# EasyEDA Pro project MFU.eprj, schematic MAIN_BOARD
Board Name: MAIN_BOARD; Create Date: 2025-10-30; Page Name: P1; Project Name: MFU_V3_mainboard; Schematic Name: MAIN_BOARD; Update Date: 2026-01-19; Company: EasyEDA.com; Page Size: A4; Version: V1.0
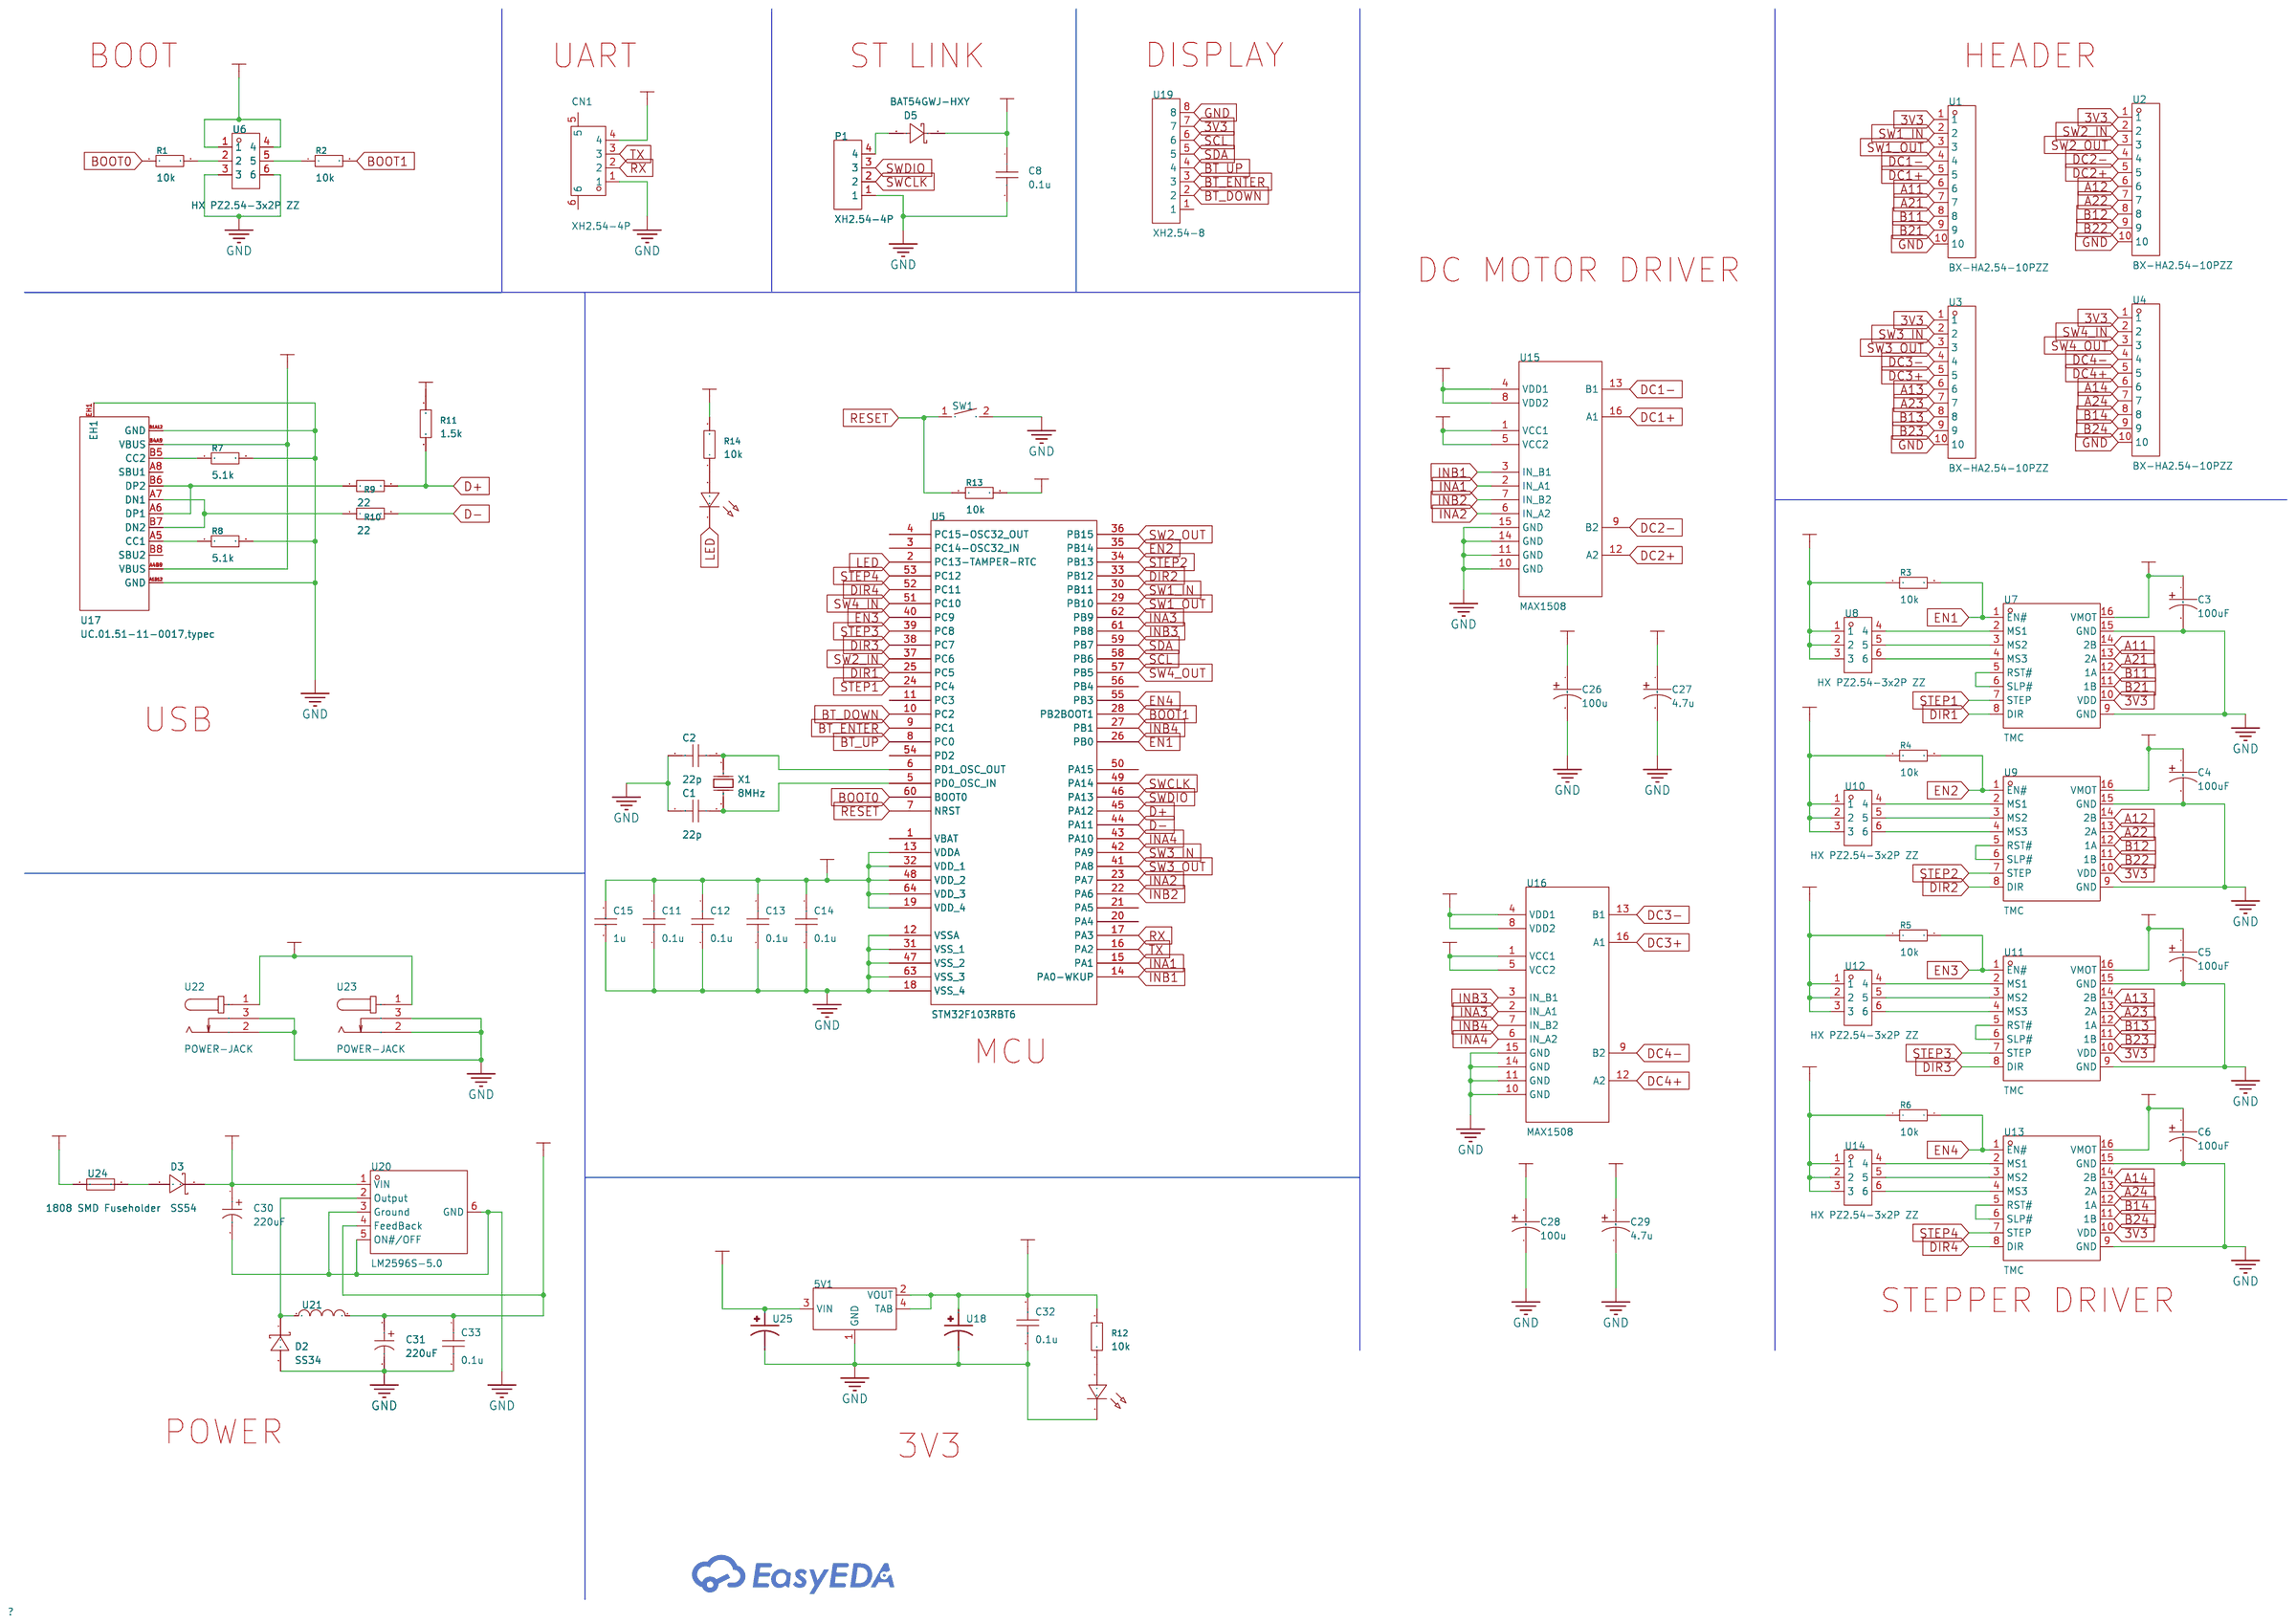
[diagram p0: schematic sheet]

## Parts
5V1  -  [SOT-223_L6.7-W3.5-P2.30-BR]
C1  22p  [C0805]
C2  22p  [C0805]
C3  100uF  [CAP-SMD_BD6.3-L6.6-W6.6-FD]
C4  100uF  [CAP-SMD_BD6.3-L6.6-W6.6-FD]
C5  100uF  [CAP-SMD_BD6.3-L6.6-W6.6-FD]
C6  100uF  [CAP-SMD_BD6.3-L6.6-W6.6-FD]
C8  0.1u  [C0805]
C11  0.1u  [C0805]
C12  0.1u  [C0805]
C13  0.1u  [C0805]
C14  0.1u  [C0805]
C15  1u  [C1206]
C26  100u  [CAP-SMD_BD6.3-L6.6-W6.6-FD]
C27  4.7u  [CAP-SMD_BD6.3-L6.6-W6.6-FD]
C28  100u  [CAP-SMD_BD6.3-L6.6-W6.6-FD]
C29  4.7u  [CAP-SMD_BD6.3-L6.6-W6.6-FD]
C30  220uF  [CAP-SMD_BD8.0-L8.3-W8.3-LS10.0-FD-1]
C31  220uF  [CAP-SMD_BD8.0-L8.3-W8.3-LS10.0-FD-1]
C32  0.1u  [C0805]
C33  0.1u  [C0805]
CN1  XH2.54-4P  [CONN-SMD_4P-P2.50-WT]
D2  SS34  [SMA_L4.4-W2.8-LS5.4-RD]
D3  SS54  [SMA_L4.4-W2.8-LS5.4-RD]
D5  BAT54GWJ-HXY  [SOD-123_L2.7-W1.6-LS3.7-RD]
LED2  -  [LED0603-R-RD]
LED3  -  [LED0603-R-RD]
P1  XH2.54-4P  [CONN-TH_4P-P2.50-XH2.54-4P]
R1  10k  [R0805]
R2  10k  [R0805]
R3  10k  [R0805]
R4  10k  [R0805]
R5  10k  [R0805]
R6  10k  [R0805]
R7  5.1k  [R0805]
R8  5.1k  [R0805]
R9  22  [R0805]
R10  22  [R0805]
R11  1.5k  [R0805]
R12  10k  [R0805]
R13  10k  [R0805]
R14  10k  [R0805]
SW1  key_3x6_2P  [SW-SMD_L6.0-W3.5-LS8.0]
U1  BX-HA2.54-10PZZ  [CONN-TH_10P-P2.50_BX-HA2.54-10PZZ]
U2  BX-HA2.54-10PZZ  [CONN-TH_10P-P2.50_BX-HA2.54-10PZZ]
U3  BX-HA2.54-10PZZ  [CONN-TH_10P-P2.50_BX-HA2.54-10PZZ]
U4  BX-HA2.54-10PZZ  [CONN-TH_10P-P2.50_BX-HA2.54-10PZZ]
U5  STM32F103RBT6  [LQFP-64_L10.0-W10.0-P0.50-LS12.0-BL]
U6  HX PZ2.54-3x2P ZZ  [HDR-TH_6P-P2.54-V-M-R3-C2-S2.54_2]
U7  TMC  [DIP-16_L20.3-W15.2-P2.54_LS12.7_A4988]
U8  HX PZ2.54-3x2P ZZ  [HDR-TH_6P-P2.54-V-M-R3-C2-S2.54_2]
U9  TMC  [DIP-16_L20.3-W15.2-P2.54_LS12.7_A4988]
U10  HX PZ2.54-3x2P ZZ  [HDR-TH_6P-P2.54-V-M-R3-C2-S2.54_2]
U11  TMC  [DIP-16_L20.3-W15.2-P2.54_LS12.7_A4988]
U12  HX PZ2.54-3x2P ZZ  [HDR-TH_6P-P2.54-V-M-R3-C2-S2.54_2]
U13  TMC  [DIP-16_L20.3-W15.2-P2.54_LS12.7_A4988]
U14  HX PZ2.54-3x2P ZZ  [HDR-TH_6P-P2.54-V-M-R3-C2-S2.54_2]
U15  MAX1508  [SOP-16_L10.0-W3.9-P1.27-LS6.0-BL]
U16  MAX1508  [SOP-16_L10.0-W3.9-P1.27-LS6.0-BL]
U17  UC.01.51-11-0017,typec  [TYPE-C-SMD_UC.01.51-11-0017]
U18  TAJA106M010RNJ  [CAPMP3216X180N]
U19  XH2.54-8  [CONN-TH_8P-P2.54_XH2.54_C9900012080]
U20  LM2596S-5.0  [TO-263-5_L10.1-W8.7-P1.70-LS14.4-BR]
U21  INDUCTOR/100uH-3A  [IND-SMD_L11.0-W10.2_CXP1050]
U22  POWER-JACK  [DC-IN-TH_POWER-JACK]
U23  POWER-JACK  [DC-IN-TH_POWER-JACK]
U24  1808 SMD Fuseholder  [FUSE-SMD_L9.7-W5.0]
U25  TAJA106M010RNJ  [CAPMP3216X180N]
X1  8MHz  [CRYSTAL-SMD_L11.5-W4.8-LS12.7]

## Library data of the parts
5V1 = AMS1117-3.3V: Supplier Footprint: SOT-223
C1 C2 C8 C11-C14 C32 C33 = CAP_0805: Supplier Footprint: 0805
C3-C6 C26-C29 = EEE0JA101AP: LCSC Part Name: 100uF ±20% 6.3V; Supplier Part: C336351; Manufacturer: PANASONIC(松下); Supplier Footprint: SMD,D6.3xL5.4mm; JLCPCB Part Class: Extended Part; Datasheet: https://atta.szlcsc.com/upload/public/pdf/source/20190304/C336351_6632A94A5AB1703B0BF3102A4E78E308.pdf; Supplier: LCSC; Tolerance: ±20%; Voltage Rating: 6.3V; Ripple Current: 71mA@120Hz; Diameter: 6.3mm; Height - Seated (Max): 5.4mm; Lifetime: 1000hrs@85℃; Operating Temperature: -40℃~+85℃
C15 = CL31A107MQHNNNE: Capacitance:100uF Tolerance:±20% Tolerance:±20% Voltage Rating:6.3V Temperature Coefficient:X5R; LCSC Part Name: 100uF ±20% 6.3V; Supplier Part: C15008; Manufacturer: SAMSUNG(三星); Supplier Footprint: 1206; JLCPCB Part Class: Basic Part; Datasheet: https://item.szlcsc.com/datasheet/CL31A107MQHNNNE/15681.html; Supplier: LCSC; Tolerance: ±20%; Voltage Rating: 6.3V; Temperature Coefficient: X5R
C30 C31 = 875075355002: LCSC Part Name: 220uF ±20% 16V; Supplier Part: C2162422; Manufacturer: Wurth(伍尔特); Supplier Footprint: SMD,D8xL11.7mm; JLCPCB Part Class: Extended Part; Datasheet: https://www.we-online.com/components/products/datasheet/875075355002.pdf; Supplier: LCSC; Tolerance: ±20%; Voltage Rating: 16V; Ripple Current: 4.7A@100kHz; Equivalent Series Resistance(ESR): 10mΩ@100kHz; Type: Polymer; Diameter: 8mm; Height - Seated (Max): 11.7mm; Lifetime: 2000hrs@105℃; Operating Temperature: -55℃~+105℃
CN1 = XH2.54-4P: Supplier Part: C9900004347; Supplier Footprint: XH2.54-3PSMD; JLCPCB Part Class: Extended Part; Supplier: LCSC
D2 D3 = SS34: LCSC Part Name: 电压:40V 电流:3A; Supplier Part: C142458; Supplier Footprint: SMA(DO-214AC); JLCPCB Part Class: Extended Part; Datasheet: https://atta.szlcsc.com/upload/public/pdf/source/20171114/C142458_15106326937931117548.pdf; Supplier: LCSC; Forward Voltage (Vf@If): 500mV@3A; Reverse Voltage (Vr): 40V; Average Rectified Current (Io): 3A
D5 = BAT54GWJ-HXY: Supplier Part: C52754565; Manufacturer: HXY MOSFET(华轩阳电子); Supplier Footprint: SOD-123; JLCPCB Part Class: Extended Part; Datasheet: https://item.szlcsc.com/datasheet/BAT54GWJ-HXY/55658096.html; Supplier: LCSC
LED2 LED3 = LED_0603-B: Supplier Footprint: 0603
P1 = XH2.54-4P_C9900003326: Supplier Part: C9900003326; JLCPCB Part Class: Extended Part; Supplier: LCSC
R1-R11 = 0805W8F1201T5E: LCSC Part Name: 1.2kΩ ±1% 125mW 厚膜电阻; Supplier Part: C17379; Manufacturer: UNI-ROYAL(厚声); Supplier Footprint: 0805; JLCPCB Part Class: Basic Part; Datasheet: https://item.szlcsc.com/datasheet/0805W8F1201T5E/18067.html; Supplier: LCSC; Type: Thick Film Resistor; Tolerance: ±1%; Power(Watts): 125mW; Voltage-Supply(Max): 150V; Temperature Coefficient: ±100ppm/℃; Operating Temperature: -55℃~+155℃
R12-R14 = 0805W8F2001T5E: Type:Thick Film Resistors Resistance:2kΩ Tolerance:±1% Tolerance:±1% Power(Watts): Overload Voltage (Max): Temperature Coefficient:±100ppm/℃ Temperature Coefficient:±100ppm/℃ Operating Temperature Range:-55℃~+155℃ Operating Temperature Range:-55℃~+155℃; LCSC Part Name: 2kΩ ±1% 125mW 厚膜电阻; Supplier Part: C17604; Manufacturer: UNI-ROYAL(厚声); Supplier Footprint: 0805; JLCPCB Part Class: Basic Part; Datasheet: https://atta.szlcsc.com/upload/public/pdf/source/20200306/C422600_1E6D84923E4A46A82E41ADD87F860B5C.pdf; Supplier: LCSC; Type: Thick Film Resistors; Tolerance: ±1%; Temperature Coefficient: ±100ppm/℃; Operating Temperature Range: -55℃~+155℃
SW1 = key_3x6_2P: Supplier Part: C9900016923; JLCPCB Part Class: Extended Part; Supplier: LCSC
U1-U4 = BX-HA2.54-10PZZ_C9900095090: Supplier Part: C9900095090; JLCPCB Part Class: Extended Part; Supplier: LCSC
U5 = STM32F103RBT6: LCSC Part Name: 主流增强型ARM Cortex-M3 MCU，具有128 KB Flash、72 MHz CPU、电机控制、USB和CAN; Supplier Part: C8735; Manufacturer: ST(意法半导体); Supplier Footprint: LQFP-64(10x10); JLCPCB Part Class: Extended Part; Datasheet: https://atta.szlcsc.com/upload/public/pdf/source/20150811/1457707344439.pdf; Supplier: LCSC; CPU Core: ARM-M3; CPU Maximum Speed: 72MHz; Program Storage Size: 128KB; Program Memory Type: FLASH; Number of I/O: 51; ADC (Bit): 12bit; Voltage - Supply: 2V~3.6V
U6 U8 U10 U12 U14 = HX PZ2.54-3x2P ZZ: Pin Structure:3x2P Pitch:2.54mm Row Spacing:2.54mm Circluar Pins/Square Pins:Pin Header Mounting Type:Through Hole Number of Rows:3 Number of Pins:6P Current Rating:3A Voltage Rating (Max):1kV Length of Mating Pin:6mm Insulation Height:2.5mm Length of End; LCSC Part Name: 3x2P 间距:2.54mm 方针 直插; Supplier Part: C32713289; Manufacturer: hanxia(韩下); Supplier Footprint: 插件,P=2.54mm; JLCPCB Part Class: Extended Part; Datasheet: https://item.szlcsc.com/datasheet/HX%2520PZ2.54-3x2P%2520ZZ/34444569.html; Supplier: LCSC; Pin Structure: 3x2P; Pitch: 2.54mm; Row Spacing: 2.54mm; Circluar Pins/Square Pins: Pin Header; Mounting Type: Through Hole; Number of Rows: 3; Number of Pins: 6P; Current Rating: 3A; Voltage Rating (Max): 1kV; Length of Mating Pin: 6mm; Insulation Height: 2.5mm; Length of End Connection Pin: 3mm; Contact Material: Brass; Contact Plating: Gold; Operating Temperature: -40℃~+105℃; Color: Black
U7 U9 U11 U13 = A4988: Supplier Part: C9900168373; Supplier Footprint: 插件; Supplier: LCSC
U15 U16 = MX1508_clone: Applications Function:Transceiver USB Protocol:USB 2.0 Voltage - Supply:3.3V；5V Voltage - Supply:3.3V；5V Data Rate:2Mbps Operating Temperature:-20℃~+70℃ Operating Temperature:-20℃~+70℃ Current - Supply:7mA Supply Current (Iq):50uA; Manufacturer: WCH(南京沁恒); Supplier: LCSC; Supplier Part: C84681; LCSC Part Name: USB转串口芯片; Supplier Footprint: SOP-16; JLCPCB Part Class: Extended Part; Datasheet: https://item.szlcsc.com/datasheet/CH340C/85852.html; Applications Function: Transceiver; USB Protocol: USB 2.0; Voltage - Supply: 3.3V；5V; Data Rate: 2Mbps; Operating Temperature: -20℃~+70℃; Current - Supply: 7mA; Supply Current (Iq): 50uA
U17 = UC.01.51-11-0017,typec: Supplier Part: C9900066641; Supplier Footprint: usb-c-smd_type-c-6pin; JLCPCB Part Class: Extended Part; Supplier: LCSC
U18 U25 = TAJA106M010RNJ: 3216 smd capacitor
U19 = XH2.54-8: Supplier Part: C9900012080; JLCPCB Part Class: Extended Part; Supplier: LCSC
U20 = LM2596S-5.0: Supplier Part: C2915310; Supplier Footprint: TO-263-5; JLCPCB Part Class: Extended Part; Supplier: LCSC
U21 = INDUCTOR/100uH-3A: Supplier: LCSC; Supplier Part: C9900204654; Supplier Footprint: SMD,10.2x11mm; JLCPCB Part Class: Extended Part
U22 U23 = POWER-JACK: Supplier Part: C9900001795; JLCPCB Part Class: Extended Part; Supplier: LCSC
U24 = 1808 SMD Fuseholder: Supplier Part: C9900157015; Supplier Footprint: SMD-2P; JLCPCB Part Class: Extended Part; Supplier: LCSC
X1 = X49SM8MSD2SC: LCSC Part Name: HC-49SMD 8MHZ 2P 49SMD 20PF ±20PPM -20~70℃（±30PPM）; Supplier Part: C12674; Manufacturer: YXC(扬兴晶振); Supplier Footprint: HC-49S-SMD; JLCPCB Part Class: Basic Part; Datasheet: https://item.szlcsc.com/datasheet/X49SM8MSD2SC/13310.html; Supplier: LCSC; Type: Crystal Oscillator; Normal temperature Frequency Tolerance: ±20ppm; Load Capacitance: 20pF; Frequency Stability: ±30ppm; Operating Temperature: -20℃~+70℃

## Nets
3V3: 5V1.2(VOUT) 5V1.4(TAB) C8.1 C11.1 C12.1 C13.1 C14.1 C15.1 C27.1 C29.1 C32.1 D5.1(C) R3.1 R4.1 R5.1 R6.1 R11.1 R12.2 R13.2 R14.2 U1.1 U2.1 U3.1 U4.1 U5.13(VDDA) U5.19(VDD_4) U5.32(VDD_1) U5.48(VDD_2) U5.64(VDD_3) U6.1 U6.4 U7.10(VDD) U8.1 U8.2 U8.3 U9.10(VDD) U10.1 U10.2 U10.3 U11.10(VDD) U12.1 U12.2 U12.3 U13.10(VDD) U14.1 U14.2 U14.3 U15.1(VCC1) U15.5(VCC2) U16.1(VCC1) U16.5(VCC2) U18.1 U19.7
5V: 5V1.3(VIN) C26.1 C28.1 C31.1 C33.1 CN1.4 U15.4(VDD1) U15.8(VDD2) U16.4(VDD1) U16.8(VDD2) U17.A4B9(VBUS) U17.B4A9(VBUS) U20.4(FeedBack) U21.2 U25.1
12V: C3.1 C4.1 C5.1 C6.1 C30.1 D3.1(K) U7.16(VMOT) U9.16(VMOT) U11.16(VMOT) U13.16(VMOT) U20.1(VIN)
12V_IN: U22.1 U23.1 U24.1
GND: 5V1.1(GND) C1.2 C2.2 C3.2 C4.2 C5.2 C6.2 C8.2 C11.2 C12.2 C13.2 C14.2 C15.2 C26.2 C27.2 C28.2 C29.2 C30.2 C31.2 C32.2 C33.2 CN1.1 D2.2(A) LED2.1(C) P1.1 R7.2 R8.2 SW1.2 U1.10 U2.10 U3.10 U4.10 U5.12(VSSA) U5.18(VSS_4) U5.31(VSS_1) U5.47(VSS_2) U5.63(VSS_3) U6.3 U6.6 U7.9(GND) U7.15(GND) U9.9(GND) U9.15(GND) U11.9(GND) U11.15(GND) U13.9(GND) U13.15(GND) U15.10(GND) U15.11(GND) U15.14(GND) U15.15(GND) U16.10(GND) U16.11(GND) U16.14(GND) U16.15(GND) U17.A1B12(GND) U17.B1A12(GND) U17.EH1 U18.2 U19.8 U20.3(Ground) U20.5(ON#/OFF) U20.6(GND) U22.2 U22.3 U23.2 U23.3 U25.2
A11: U1.6 U7.14(2B)
A12: U2.6 U9.14(2B)
A13: U3.6 U11.14(2B)
A14: U4.6 U13.14(2B)
A21: U1.7 U7.13(2A)
A22: U2.7 U9.13(2A)
A23: U3.7 U11.13(2A)
A24: U4.7 U13.13(2A)
B11: U1.8 U7.12(1A)
B12: U2.8 U9.12(1A)
B13: U3.8 U11.12(1A)
B14: U4.8 U13.12(1A)
B21: U1.9 U7.11(1B)
B22: U2.9 U9.11(1B)
B23: U3.9 U11.11(1B)
B24: U4.9 U13.11(1B)
BOOT0: R1.1 U5.60(BOOT0)
BOOT1: R2.2 U5.28(PB2BOOT1)
BT_DOWN: U5.10(PC2) U19.2
BT_ENTER: U5.9(PC1) U19.3
BT_UP: U5.8(PC0) U19.4
D+: R9.2 R11.2 U5.45(PA12)
D-: R10.2 U5.44(PA11)
DC1+: U1.5 U15.16(A1)
DC1-: U1.4 U15.13(B1)
DC2+: U2.5 U15.12(A2)
DC2-: U2.4 U15.9(B2)
DC3+: U3.5 U16.16(A1)
DC3-: U3.4 U16.13(B1)
DC4+: U4.5 U16.12(A2)
DC4-: U4.4 U16.9(B2)
DIR1: U5.25(PC5) U7.8(DIR)
DIR2: U5.33(PB12) U9.8(DIR)
DIR3: U5.38(PC7) U11.8(DIR)
DIR4: U5.52(PC11) U13.8(DIR)
EN1: R3.2 U5.26(PB0) U7.1(EN#)
EN2: R4.2 U5.35(PB14) U9.1(EN#)
EN3: R5.2 U5.40(PC9) U11.1(EN#)
EN4: R6.2 U5.55(PB3) U13.1(EN#)
INA1: U5.15(PA1) U15.2(IN_A1)
INA2: U5.23(PA7) U15.6(IN_A2)
INA3: U5.62(PB9) U16.2(IN_A1)
INA4: U5.43(PA10) U16.6(IN_A2)
INB1: U5.14(PA0-WKUP) U15.3(IN_B1)
INB2: U5.22(PA6) U15.7(IN_B2)
INB3: U5.61(PB8) U16.3(IN_B1)
INB4: U5.27(PB1) U16.7(IN_B2)
LED: LED3.1(C) U5.2(PC13-TAMPER-RTC)
RESET: R13.1 SW1.1 U5.7(NRST)
RX: CN1.2 U5.17(PA3)
SCL: U5.58(PB6) U19.6
SDA: U5.59(PB7) U19.5
STEP1: U5.24(PC4) U7.7(STEP)
STEP2: U5.34(PB13) U9.7(STEP)
STEP3: U5.39(PC8) U11.7(STEP)
STEP4: U5.53(PC12) U13.7(STEP)
SW1_IN: U1.2 U5.30(PB11)
SW1_OUT: U1.3 U5.29(PB10)
SW2_IN: U2.2 U5.37(PC6)
SW2_OUT: U2.3 U5.36(PB15)
SW3_IN: U3.2 U5.42(PA9)
SW3_OUT: U3.3 U5.41(PA8)
SW4_IN: U4.2 U5.51(PC10)
SW4_OUT: U4.3 U5.57(PB5)
SWCLK: P1.2 U5.49(PA14)
SWDIO: P1.3 U5.46(PA13)
TX: CN1.3 U5.16(PA2)
$1N1496: C2.1 U5.6(PD1 OSC_OUT) X1.1(OSC1)
$1N1502: C1.1 U5.5(PD0 OSC_IN) X1.2(OSC2)
$1N1990: R1.2 U6.2
$1N1994: R2.1 U6.5
$1N3361: U7.5(RST#) U7.6(SLP#)
$1N3426: U7.2(MS1) U8.4
$1N3430: U7.3(MS2) U8.5
$1N3435: U7.4(MS3) U8.6
$1N3971: U9.5(RST#) U9.6(SLP#)
$1N3975: U9.2(MS1) U10.4
$1N3977: U9.3(MS2) U10.5
$1N3979: U9.4(MS3) U10.6
$1N4314: U11.5(RST#) U11.6(SLP#)
$1N4318: U11.2(MS1) U12.4
$1N4320: U11.3(MS2) U12.5
$1N4322: U11.4(MS3) U12.6
$1N4657: U13.5(RST#) U13.6(SLP#)
$1N4661: U13.2(MS1) U14.4
$1N4663: U13.3(MS2) U14.5
$1N4665: U13.4(MS3) U14.6
$1N7887: R7.1 U17.B5(CC2)
$1N7903: R8.1 U17.A5(CC1)
$1N7921: R9.1 U17.A6(DP1) U17.B6(DP2)
$1N7927: R10.1 U17.A7(DN1) U17.B7(DN2)
$1N8511: LED2.2(A) R12.1
$1N9497: D2.1(K) U20.2(Output) U21.1
$1N12294: LED3.2(A) R14.1
$1N23968: D3.2(A) U24.2
$1N24174: D5.2(A) P1.4

Not connected (* = marked no-connect by the designer): CN1 5 6; U5 1(VBAT) 3(PC14-OSC32_IN) 4(PC15-OSC32_OUT) 11(PC3) 20(PA4) 21(PA5) 50(PA15) 54(PD2) 56(PB4); U17 A8(SBU1) B8(SBU2); U19 1

## Notes on the sheet
- BOOT
- UART
- ST LINK
- DISPLAY
- HEADER
- DC MOTOR DRIVER
- USB
- MCU
- STEPPER DRIVER
- POWER
- 3V3
